# Altium project T3tris.PrjPcb
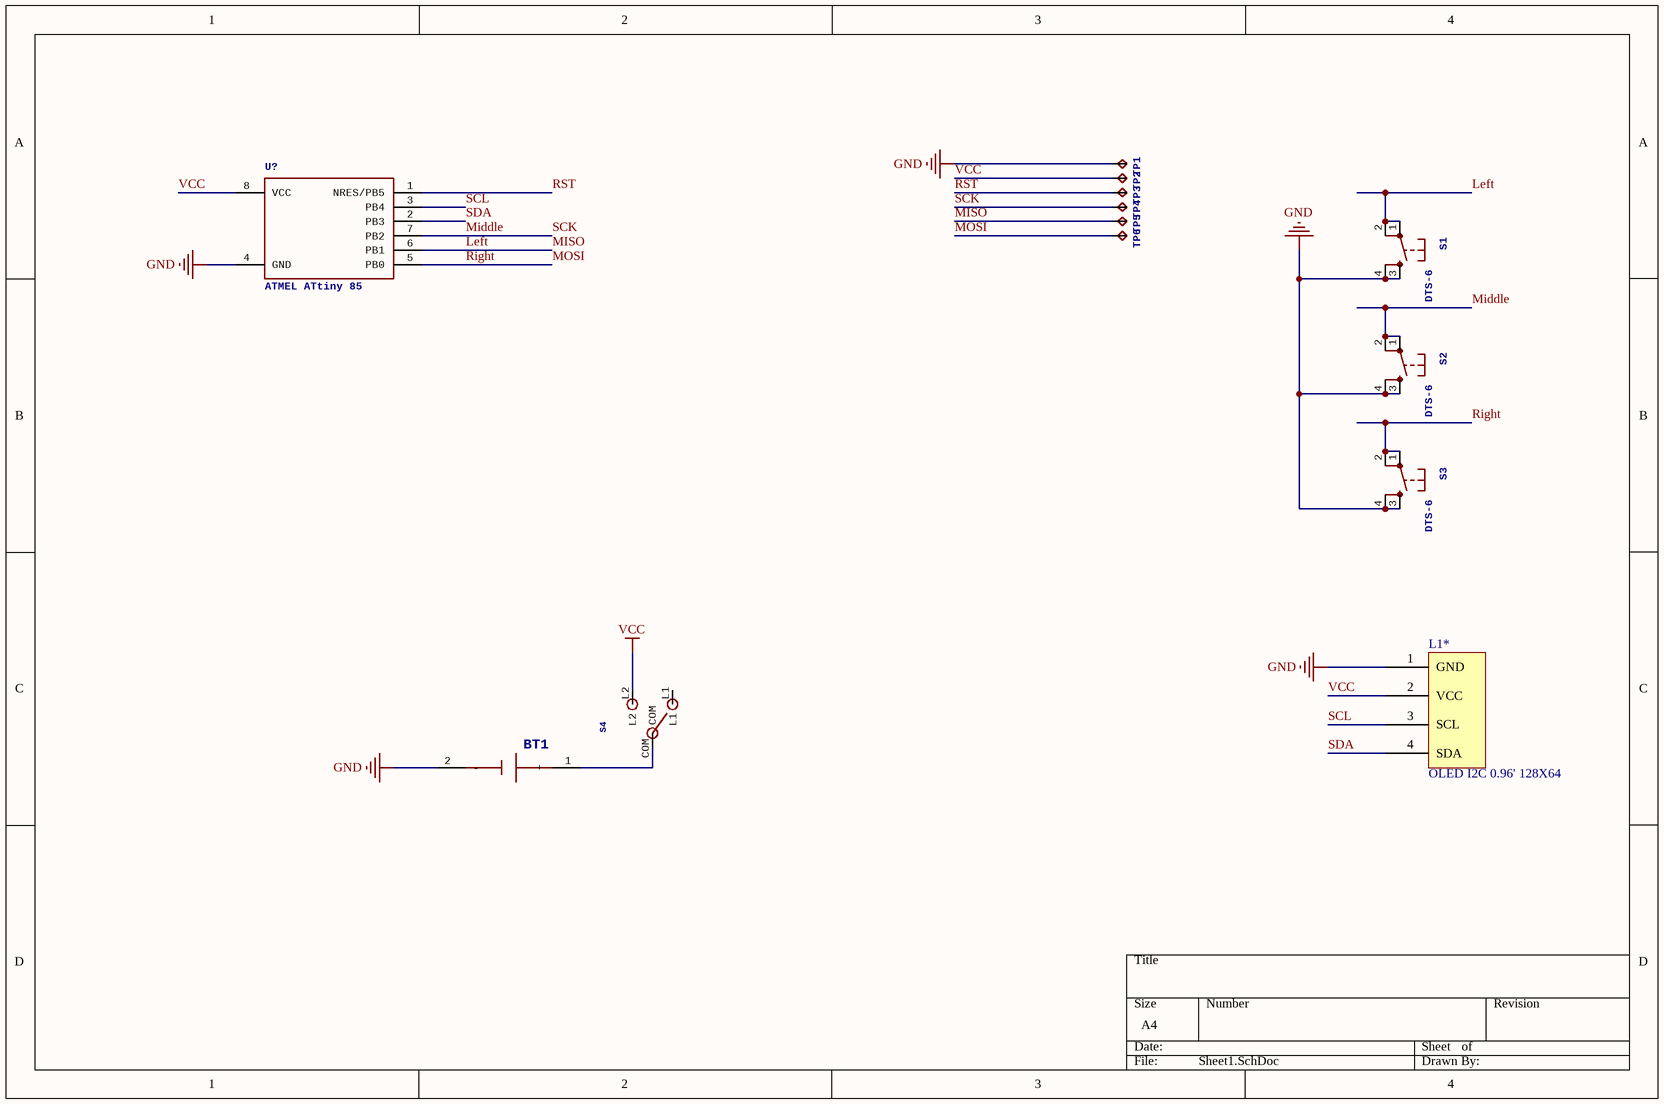
[diagram p0: Sheet1.SchDoc]
1 sheet, 13 parts. Net scope: global (net labels, ports and power ports of the same name join across sheets).
Board files: PCB1.PcbDoc, LOGO.PcbDoc

## Sheet Sheet1.SchDoc
size A4

### Parts
BT1  (no value)  [CR2032 Holder _ "White"]
L1*  OLED I2C 0.96' 128X64  [OLED I2C 0.96' 128X64]
S1  DTS-6  [DTS-6]
S2  DTS-6  [DTS-6]
S3  DTS-6  [DTS-6]
S4  (no value)  [MSK-12C02]
TP1  Test pad  [TP15R]  (value not drawn)
TP2  Test pad  [TP15R]  (value not drawn)
TP3  Test pad  [TP15R]  (value not drawn)
TP4  Test pad  [TP15R]  (value not drawn)
TP5  Test pad  [TP15R]  (value not drawn)
TP6  Test pad  [TP15R]  (value not drawn)
U?  ATMEL ATtiny 85  [ATTINY85]

### Nets
GND: BT1.2(-) L1*.1(GND) S1.3 S1.4 S2.3 S2.4 S3.3 S3.4 TP1.TP U?.4(GND)
VCC: L1*.2(VCC) S4.L2 TP2.TP U?.8(VCC)
Left: S1.1 S1.2 TP5.TP U?.6(PB1)  [also labelled MISO]
Middle: S2.1 S2.2 TP4.TP U?.7(PB2)  [also labelled SCK]
MOSI: S3.1 S3.2 TP6.TP U?.5(PB0)  [also labelled Right]
RST: TP3.TP U?.1(NRES/PB5)
SCL: L1*.3(SCL) U?.3(PB4)
SDA: L1*.4(SDA) U?.2(PB3)
NetBT1_1: BT1.1(+) S4.COM

Not connected (* = marked no-connect by the designer): S4 L1

### Library data of the parts
BT1 = BU2032SM-BT-GTR: MF: MPD; Price: 0.64 USD; Package: None; Availability: Good; MP: BU2032SM-BT-GTR
S4 = MSK-12C02_SMD_SPDT_SWITCH
TP1-TP6 = TPTP15R
U? = ATTINY85SU